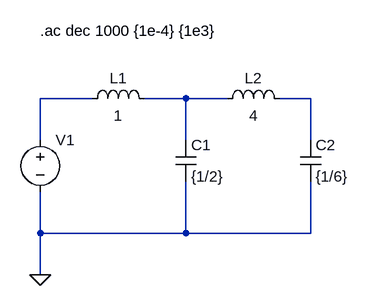
[diagram p0: schematic TS10_Cauer_2_LTSpice.asc]
TS10_Cauer_2_LTSpice.asc, the LTspice schematic file:
Version 4
SHEET 1 880 680
WIRE 48 96 -32 96
WIRE 192 96 128 96
WIRE 256 96 192 96
WIRE 384 96 336 96
WIRE -32 160 -32 96
WIRE 192 160 192 96
WIRE 384 160 384 96
WIRE -32 304 -32 240
WIRE 192 304 192 224
WIRE 192 304 -32 304
WIRE 384 304 384 224
WIRE 384 304 192 304
WIRE -32 368 -32 304
FLAG -32 368 0
SYMBOL ind 32 112 R270
WINDOW 0 32 56 VTop 2
WINDOW 3 5 56 VBottom 2
SYMATTR InstName L1
SYMATTR Value 1
SYMBOL ind 240 112 R270
WINDOW 0 32 56 VTop 2
WINDOW 3 5 56 VBottom 2
SYMATTR InstName L2
SYMATTR Value 4
SYMBOL cap 176 160 R0
SYMATTR InstName C1
SYMATTR Value {1/2}
SYMBOL cap 368 160 R0
SYMATTR InstName C2
SYMATTR Value {1/6}
SYMBOL voltage -32 144 R0
WINDOW 39 0 0 Left 0
SYMATTR InstName V1
SYMATTR Value ""
SYMATTR Value2 AC 1 0
TEXT -32 -8 Left 2 !.ac dec 1000 {1e-4} {1e3}

The netlist it stands for:
* TS10_Cauer_2_LTSpice.asc
L1 N001 N002 1
L2 N002 N003 4
C1 N002 0 {1/2}
C2 N003 0 {1/6}
V1 N001 0 AC 1 0
.ac dec 1000 {1e-4} {1e3}
.backanno
.end